# Altium schematic sheet 04-mcu2.SchDoc: MCU
size Letter; DrawnBy: J. Brinton; Engineer: J. Brinton; Revision: 1; SheetNumber: 4; SheetTotal: 14
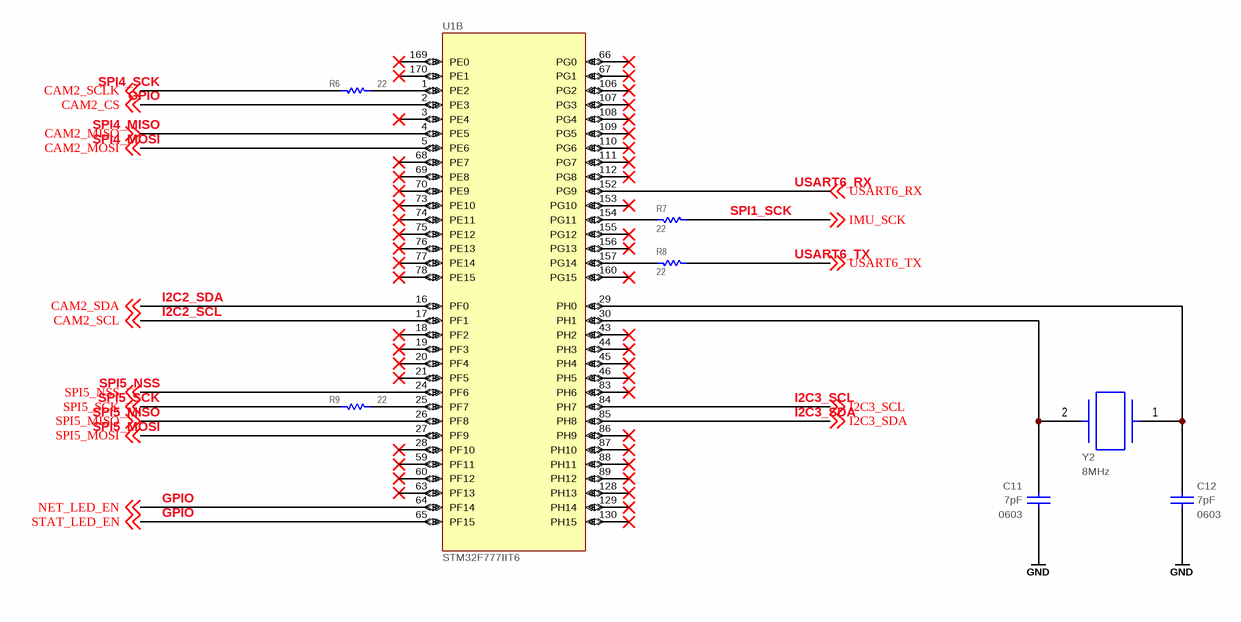
[diagram p0: 04-mcu2.SchDoc]

## Parts
C11  value 7pF  Package: 0603  [CAPC160X80X90L20N]  (hidden comment: CL10C070CB8NNNC)
C12  value 7pF  Package: 0603  [CAPC160X80X90L20N]  (hidden comment: CL10C070CB8NNNC)
R6  value 22  [RESC2012X70N]  (hidden comment: ERJ-6ENF22R0V)
R7  value 22  [RESC2012X70N]  (hidden comment: ERJ-6ENF22R0V)
R8  value 22  [RESC2012X70N]  (hidden comment: ERJ-6ENF22R0V)
R9  value 22  [RESC2012X70N]  (hidden comment: ERJ-6ENF22R0V)
U1  STM32F777IIT6  [TSQFP50P2600X2600X160-176N]  (part B of 4)
Y2  Frequency: 8MHz  [ABLS]  (hidden comment: ABLS-8.000MHZ-B2-T)

## Nets
GND: C11.1 C12.1
CAM2_CS: U1.2(PE3) ; off-sheet CAM2_CS
CAM2_MISO: U1.4(PE5) ; off-sheet CAM2_MISO
CAM2_MOSI: U1.5(PE6) ; off-sheet CAM2_MOSI
CAM2_SCL: U1.17(PF1) ; off-sheet CAM2_SCL
CAM2_SCLK: R6.1 ; off-sheet CAM2_SCLK
CAM2_SDA: U1.16(PF0) ; off-sheet CAM2_SDA
I2C3_SCL: U1.84(PH7) ; off-sheet I2C3_SCL
I2C3_SDA: U1.85(PH8) ; off-sheet I2C3_SDA
IMU_SCK: R7.2 ; off-sheet IMU_SCK
NET_LED_EN: U1.64(PF14) ; off-sheet NET_LED_EN
SPI5_MISO: U1.26(PF8) ; off-sheet SPI5_MISO
SPI5_MOSI: U1.27(PF9) ; off-sheet SPI5_MOSI
SPI5_NSS: U1.24(PF6) ; off-sheet SPI5_NSS
SPI5_SCK: R9.1 ; off-sheet SPI5_SCK
STAT_LED_EN: U1.65(PF15) ; off-sheet STAT_LED_EN
USART6_RX: U1.152(PG9) ; off-sheet USART6_RX
USART6_TX: R8.2 ; off-sheet USART6_TX
NetC11_2: C11.2 U1.30(PH1) Y2.2(XTAL2)
NetC12_2: C12.2 U1.29(PH0) Y2.1(XTAL1)
NetR6_2: R6.2 U1.1(PE2)
NetR7_1: R7.1 U1.154(PG11)
NetR8_1: R8.1 U1.157(PG14)
NetR9_2: R9.2 U1.25(PF7)

Not connected (* = marked no-connect by the designer): U1 3(PE4)* 18(PF2)* 19(PF3)* 20(PF4)* 21(PF5)* 28(PF10)* 43(PH2)* 44(PH3)* 45(PH4)* 46(PH5)* 59(PF11)* 60(PF12)* 63(PF13)* 66(PG0)* 67(PG1)* 68(PE7)* 69(PE8)* 70(PE9)* 73(PE10)* 74(PE11)* 75(PE12)* 76(PE13)* 77(PE14)* 78(PE15)* 83(PH6)* 86(PH9)* 87(PH10)* 88(PH11)* 89(PH12)* 106(PG2)* 107(PG3)* 108(PG4)* 109(PG5)* 110(PG6)* 111(PG7)* 112(PG8)* 128(PH13)* 129(PH14)* 130(PH15)* 153(PG10)* 155(PG12)* 156(PG13)* 160(PG15)* 169(PE0)* 170(PE1)*

## Notes on the sheet
- SPI4_SCK
- GPIO
- SPI4_MISO
- SPI4_MOSI
- USART6_RX
- SPI1_SCK
- USART6_TX
- I2C2_SDA
- I2C2_SCL
- SPI5_NSS
- SPI5_SCK
- I2C3_SCL
- SPI5_MISO
- SPI5_MOSI
- I2C3_SDA
- Designed By:
- Title
- Engineer
- Revision
- Drawn By
- Date
- Sheet
- of

## Library data of the parts
C11 C12 = CAP: Ceramic Capacitor 7pF +/-0.25pF 0603; Manufacturer: Samsung; Tr: -55:125; Voltage: 50V; Manufacturer P/N: CL10C070CB8NNNC; Tolerance: +/-0.25pF
R6-R9 = RES 0402: Thick Film Resistor 22 ±1% 0805; Manufacturer: Panasonic; Tr: -55:155; Package: 0805; Manufacturer P/N: ERJ-6ENF22R0V; Tolerance: ±1%
U1 = STM32F777IIT: Microcontroller; Manufacturer: STMicroelectronics; Manufacturer P/N: STM32F777IIT6
Y2 = ABLS-8.000MHZ-B2-T: CRYSTAL 8MHZ 18PF SMD; Manufacturer: Abracon LLC; Frequency Tolerance: ±20ppm; package: 2-SMD; Load Capacitance: 18pF; ComponentLink1URL: http://www.abracon.com/Resonators/ABS07.pdf; ComponentLink1Description: Series Datasheet; Manufacturer P/N: ABLS-8.000MHZ-B2-T